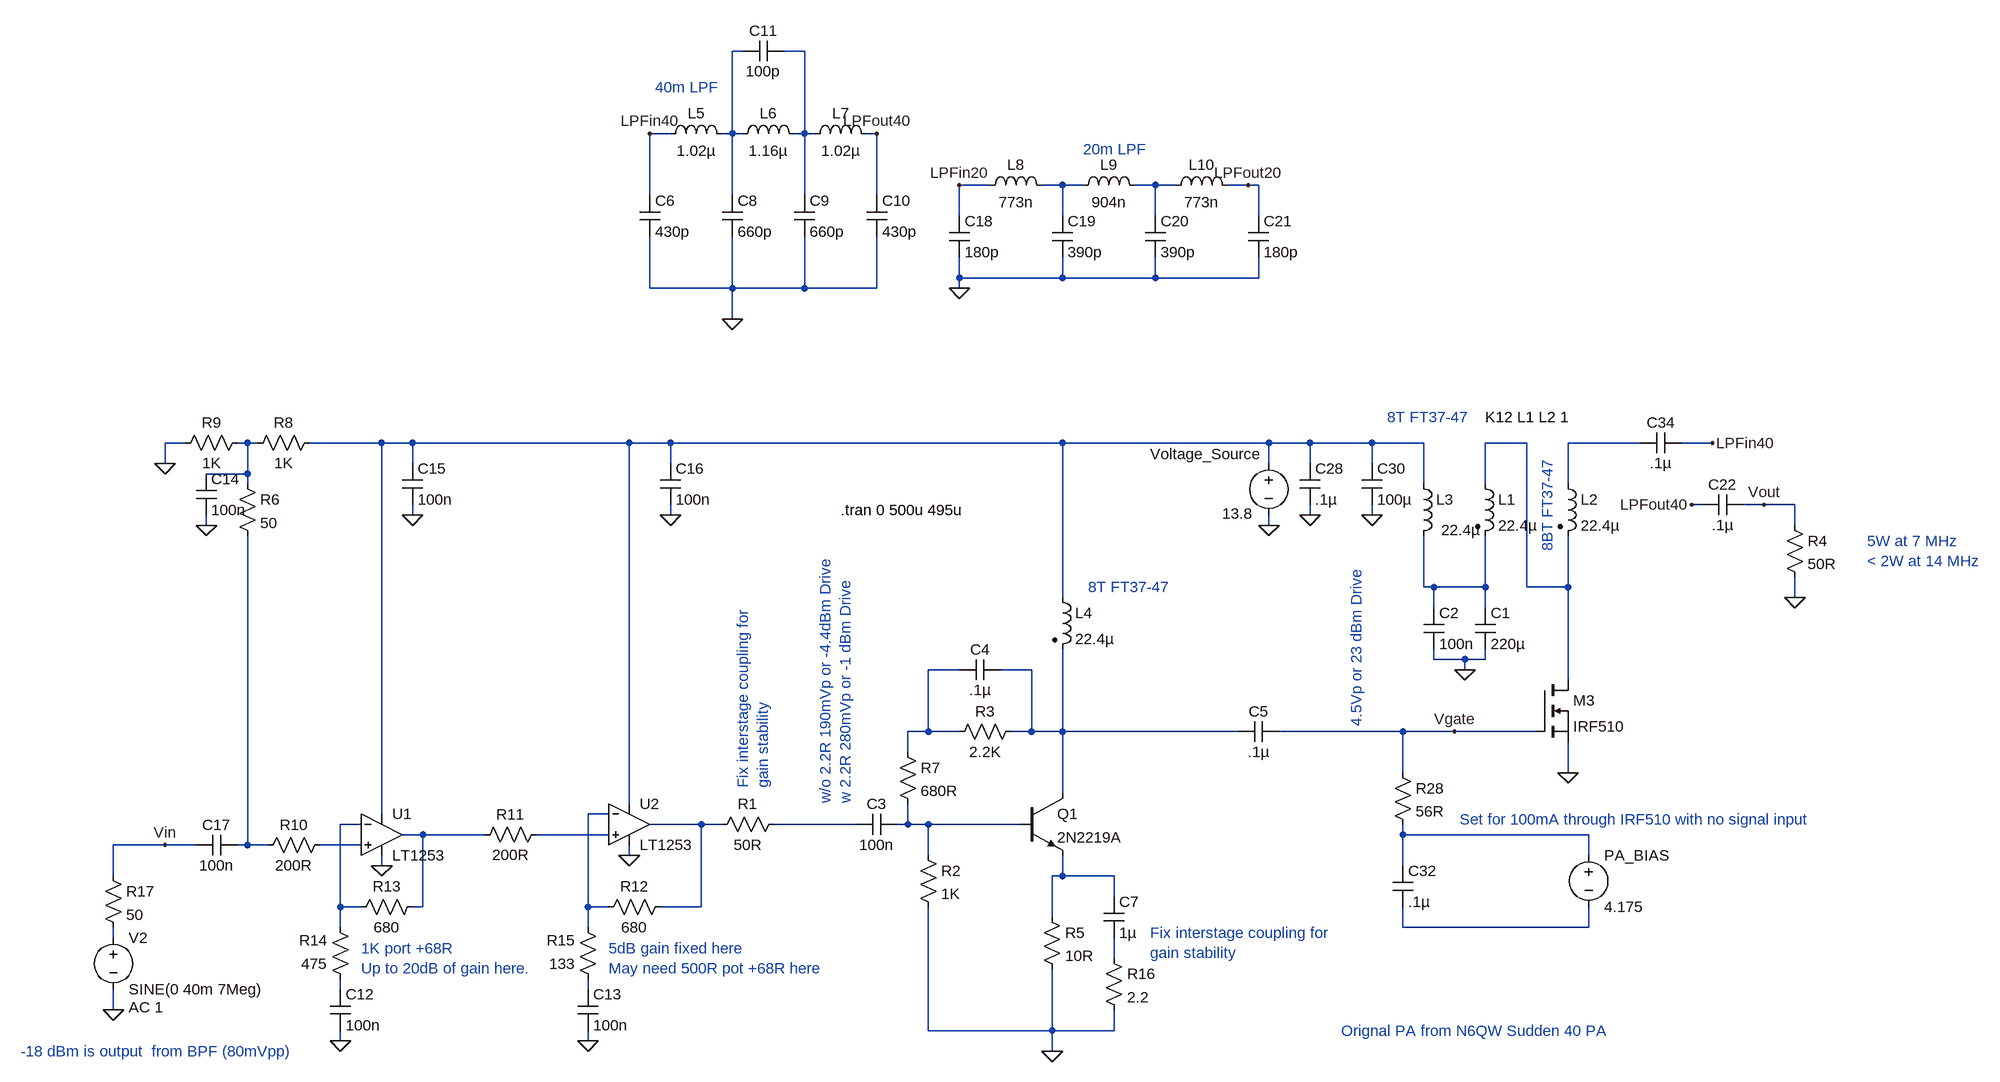
[diagram p0: schematic Power Amp LT1253+Driver+IRF510 Stage.asc]
Power Amp LT1253+Driver+IRF510 Stage.asc, the LTspice schematic file:
Version 4
SHEET 1 2716 3076
WIRE -368 784 -384 784
WIRE -272 784 -304 784
WIRE -480 912 -512 912
WIRE -384 912 -384 784
WIRE -384 912 -400 912
WIRE -368 912 -384 912
WIRE -272 912 -272 784
WIRE -272 912 -288 912
WIRE -256 912 -272 912
WIRE -160 912 -176 912
WIRE 16 992 -32 992
WIRE 128 992 96 992
WIRE 160 992 128 992
WIRE 272 992 240 992
WIRE 304 992 272 992
WIRE 416 992 384 992
WIRE 432 992 416 992
WIRE -512 1008 -512 912
WIRE -384 1008 -384 912
WIRE -272 1008 -272 912
WIRE -160 1008 -160 912
WIRE -32 1040 -32 992
WIRE 128 1040 128 992
WIRE 272 1040 272 992
WIRE 432 1040 432 992
WIRE -32 1136 -32 1104
WIRE 128 1136 128 1104
WIRE 128 1136 -32 1136
WIRE 272 1136 272 1104
WIRE 272 1136 128 1136
WIRE 432 1136 432 1104
WIRE 432 1136 272 1136
WIRE -512 1152 -512 1072
WIRE -384 1152 -384 1072
WIRE -384 1152 -512 1152
WIRE -272 1152 -272 1072
WIRE -272 1152 -384 1152
WIRE -160 1152 -160 1072
WIRE -160 1152 -272 1152
WIRE -32 1152 -32 1136
WIRE -384 1200 -384 1152
WIRE -1232 1392 -1264 1392
WIRE -1136 1392 -1152 1392
WIRE -1120 1392 -1136 1392
WIRE -928 1392 -1040 1392
WIRE -880 1392 -928 1392
WIRE -544 1392 -880 1392
WIRE -480 1392 -544 1392
WIRE 128 1392 -480 1392
WIRE 448 1392 128 1392
WIRE 512 1392 448 1392
WIRE 608 1392 512 1392
WIRE 688 1392 608 1392
WIRE 848 1392 784 1392
WIRE 1024 1392 912 1392
WIRE 1136 1392 1088 1392
WIRE -1264 1424 -1264 1392
WIRE -880 1424 -880 1392
WIRE -480 1424 -480 1392
WIRE 448 1424 448 1392
WIRE 512 1424 512 1392
WIRE 608 1424 608 1392
WIRE -1136 1440 -1136 1392
WIRE -1136 1440 -1200 1440
WIRE -1136 1456 -1136 1440
WIRE 688 1456 688 1392
WIRE 784 1456 784 1392
WIRE 912 1456 912 1392
WIRE 1120 1488 1104 1488
WIRE 1216 1488 1184 1488
WIRE 1264 1488 1216 1488
WIRE -880 1504 -880 1488
WIRE -480 1504 -480 1488
WIRE 512 1504 512 1488
WIRE 608 1504 608 1488
WIRE -1200 1520 -1200 1504
WIRE 448 1520 448 1504
WIRE 1264 1520 1264 1488
WIRE 688 1616 688 1536
WIRE 704 1616 688 1616
WIRE 784 1616 784 1536
WIRE 784 1616 704 1616
WIRE 848 1616 848 1392
WIRE 912 1616 912 1536
WIRE 912 1616 848 1616
WIRE 128 1632 128 1392
WIRE 1264 1632 1264 1600
WIRE 704 1648 704 1616
WIRE 784 1648 784 1616
WIRE 704 1728 704 1712
WIRE 752 1728 704 1728
WIRE 784 1728 784 1712
WIRE 784 1728 752 1728
WIRE -32 1744 -80 1744
WIRE 80 1744 32 1744
WIRE 752 1744 752 1728
WIRE 912 1760 912 1616
WIRE -80 1840 -80 1744
WIRE -80 1840 -112 1840
WIRE -32 1840 -80 1840
WIRE 80 1840 80 1744
WIRE 80 1840 48 1840
WIRE 128 1840 128 1712
WIRE 128 1840 80 1840
WIRE 400 1840 128 1840
WIRE 656 1840 464 1840
WIRE 736 1840 656 1840
WIRE 864 1840 736 1840
WIRE -112 1872 -112 1840
WIRE 656 1904 656 1840
WIRE 912 1904 912 1856
WIRE 128 1936 128 1840
WIRE -544 1952 -544 1392
WIRE -928 1968 -928 1392
WIRE -576 1968 -608 1968
WIRE -960 1984 -992 1984
WIRE -432 1984 -512 1984
WIRE -400 1984 -432 1984
WIRE -192 1984 -320 1984
WIRE -112 1984 -112 1952
WIRE -112 1984 -128 1984
WIRE -80 1984 -112 1984
WIRE 64 1984 -80 1984
WIRE -864 2000 -896 2000
WIRE -768 2000 -864 2000
WIRE -576 2000 -688 2000
WIRE 656 2000 656 1984
WIRE 944 2000 656 2000
WIRE -1264 2016 -1344 2016
WIRE -1216 2016 -1264 2016
WIRE -1136 2016 -1136 1536
WIRE -1136 2016 -1152 2016
WIRE -1104 2016 -1136 2016
WIRE -960 2016 -1024 2016
WIRE -544 2032 -544 2016
WIRE -80 2032 -80 1984
WIRE 944 2032 944 2000
WIRE -928 2048 -928 2032
WIRE 656 2048 656 2000
WIRE -1344 2064 -1344 2016
WIRE 128 2064 128 2032
WIRE 128 2064 112 2064
WIRE 208 2064 128 2064
WIRE 208 2096 208 2064
WIRE -992 2112 -992 1984
WIRE -960 2112 -992 2112
WIRE -864 2112 -864 2000
WIRE -864 2112 -880 2112
WIRE -608 2112 -608 1968
WIRE -576 2112 -608 2112
WIRE -432 2112 -432 1984
WIRE -432 2112 -496 2112
WIRE 112 2128 112 2064
WIRE -992 2144 -992 2112
WIRE -608 2144 -608 2112
WIRE 656 2144 656 2112
WIRE 944 2144 944 2112
WIRE 944 2144 656 2144
WIRE -1344 2160 -1344 2144
WIRE 208 2192 208 2160
WIRE -992 2240 -992 2224
WIRE -608 2240 -608 2224
WIRE -1344 2272 -1344 2240
WIRE -80 2304 -80 2112
WIRE 112 2304 112 2208
WIRE 112 2304 -80 2304
WIRE 208 2304 208 2272
WIRE 208 2304 112 2304
WIRE -992 2320 -992 2304
WIRE -608 2320 -608 2304
WIRE 112 2336 112 2304
FLAG 512 1504 0
FLAG 608 1504 0
FLAG 912 1904 0
FLAG 736 1840 Vgate
FLAG 448 1520 0
FLAG 752 1744 0
FLAG -1264 2016 Vin
FLAG 112 2336 0
FLAG 1264 1632 0
FLAG 1216 1488 Vout
FLAG -384 1200 0
FLAG -880 1504 0
FLAG -1200 1520 0
FLAG -928 2048 0
FLAG -544 2032 0
FLAG -608 2320 0
FLAG -1344 2272 0
FLAG -480 1504 0
FLAG -1264 1424 0
FLAG -992 2320 0
FLAG -32 1152 0
FLAG -512 912 LPFin40
FLAG -160 912 LPFout40
FLAG -32 992 LPFin20
FLAG 416 992 LPFout20
FLAG 1104 1488 LPFout40
FLAG 1136 1392 LPFin40
SYMBOL nmos 864 1760 R0
SYMATTR InstName M3
SYMATTR Value IRF510
SYMBOL voltage 448 1408 R0
WINDOW 123 0 0 Left 2
WINDOW 39 0 0 Left 2
WINDOW 0 -184 1 Left 2
WINDOW 3 -72 94 Left 2
SYMATTR InstName Voltage_Source
SYMATTR Value 13.8
SYMBOL cap 496 1424 R0
SYMATTR InstName C28
SYMATTR Value .1µ
SYMBOL ind2 768 1440 R0
SYMATTR InstName L1
SYMATTR Value 22.4µ
SYMATTR Type ind
SYMBOL ind2 896 1440 R0
SYMATTR InstName L2
SYMATTR Value 22.4µ
SYMATTR Type ind
SYMBOL ind 672 1440 R0
WINDOW 3 43 87 Left 2
SYMATTR Value 22.4µ
SYMATTR InstName L3
SYMBOL cap 592 1424 R0
SYMATTR InstName C30
SYMATTR Value 100µ
SYMBOL res 640 1888 R0
SYMATTR InstName R28
SYMATTR Value 56R
SYMBOL cap 640 2048 R0
SYMATTR InstName C32
SYMATTR Value .1µ
SYMBOL voltage 944 2016 R0
WINDOW 123 0 0 Left 2
WINDOW 39 0 0 Left 2
SYMATTR InstName PA_BIAS
SYMATTR Value 4.175
SYMBOL cap 1088 1376 R90
WINDOW 0 0 32 VBottom 2
WINDOW 3 32 32 VTop 2
SYMATTR InstName C34
SYMATTR Value .1µ
SYMBOL cap 768 1648 R0
SYMATTR InstName C1
SYMATTR Value 220µ
SYMBOL cap 688 1648 R0
SYMATTR InstName C2
SYMATTR Value 100n
SYMBOL npn 64 1936 R0
SYMATTR InstName Q1
SYMATTR Value 2N2219A
SYMBOL res -96 2016 R0
SYMATTR InstName R2
SYMATTR Value 1K
SYMBOL res 64 1824 R90
WINDOW 0 0 56 VBottom 2
WINDOW 3 32 56 VTop 2
SYMATTR InstName R3
SYMATTR Value 2.2K
SYMBOL cap 32 1728 R90
WINDOW 0 0 32 VBottom 2
WINDOW 3 32 32 VTop 2
SYMATTR InstName C4
SYMATTR Value .1µ
SYMBOL ind2 112 1616 R0
SYMATTR InstName L4
SYMATTR Value 22.4µ
SYMATTR Type ind
SYMBOL res 96 2112 R0
SYMATTR InstName R5
SYMATTR Value 10R
SYMBOL res -128 1856 R0
SYMATTR InstName R7
SYMATTR Value 680R
SYMBOL cap 192 2096 R0
SYMATTR InstName C7
SYMATTR Value 1µ
SYMBOL res 1248 1504 R0
SYMATTR InstName R4
SYMATTR Value 50R
SYMBOL ind -496 928 R270
WINDOW 0 32 56 VTop 2
WINDOW 3 5 56 VBottom 2
SYMATTR InstName L5
SYMATTR Value 1.02µ
SYMBOL ind -384 928 R270
WINDOW 0 32 56 VTop 2
WINDOW 3 5 56 VBottom 2
SYMATTR InstName L6
SYMATTR Value 1.16µ
SYMBOL ind -272 928 R270
WINDOW 0 32 56 VTop 2
WINDOW 3 5 56 VBottom 2
SYMATTR InstName L7
SYMATTR Value 1.02µ
SYMBOL cap -528 1008 R0
SYMATTR InstName C6
SYMATTR Value 430p
SYMBOL cap -400 1008 R0
SYMATTR InstName C8
SYMATTR Value 660p
SYMBOL cap -288 1008 R0
SYMATTR InstName C9
SYMATTR Value 660p
SYMBOL cap -176 1008 R0
SYMATTR InstName C10
SYMATTR Value 430p
SYMBOL cap -304 768 R90
WINDOW 0 0 32 VBottom 2
WINDOW 3 32 32 VTop 2
SYMATTR InstName C11
SYMATTR Value 100p
SYMBOL Opamps\\LT1253 -928 1936 R0
SYMATTR InstName U1
SYMBOL Opamps\\LT1253 -544 1920 R0
SYMATTR InstName U2
SYMBOL voltage -1344 2144 R0
WINDOW 123 24 124 Left 2
WINDOW 39 0 0 Left 2
SYMATTR Value2 AC 1
SYMATTR InstName V2
SYMATTR Value SINE(0 40m 7Meg)
SYMBOL res -1152 1440 R0
SYMATTR InstName R6
SYMATTR Value 50
SYMBOL res -1024 1376 R90
WINDOW 0 0 56 VBottom 2
WINDOW 3 32 56 VTop 2
SYMATTR InstName R8
SYMATTR Value 1K
SYMBOL res -1136 1376 R90
WINDOW 0 0 56 VBottom 2
WINDOW 3 32 56 VTop 2
SYMATTR InstName R9
SYMATTR Value 1K
SYMBOL res -1008 2000 R90
WINDOW 0 0 56 VBottom 2
WINDOW 3 32 56 VTop 2
SYMATTR InstName R10
SYMATTR Value 200R
SYMBOL res -672 1984 R90
WINDOW 0 0 56 VBottom 2
WINDOW 3 32 56 VTop 2
SYMATTR InstName R11
SYMATTR Value 200R
SYMBOL res -480 2096 R90
WINDOW 0 0 56 VBottom 2
WINDOW 3 32 56 VTop 2
SYMATTR InstName R12
SYMATTR Value 680
SYMBOL res -864 2096 R90
WINDOW 0 0 56 VBottom 2
WINDOW 3 32 56 VTop 2
SYMATTR InstName R13
SYMATTR Value 680
SYMBOL res -976 2240 R180
WINDOW 0 36 76 Left 2
WINDOW 3 36 40 Left 2
SYMATTR InstName R14
SYMATTR Value 475
SYMBOL res -592 2240 R180
WINDOW 0 36 76 Left 2
WINDOW 3 36 40 Left 2
SYMATTR InstName R15
SYMATTR Value 133
SYMBOL cap -1008 2240 R0
SYMATTR InstName C12
SYMATTR Value 100n
SYMBOL cap -624 2240 R0
SYMATTR InstName C13
SYMATTR Value 100n
SYMBOL cap -1216 1440 R0
SYMATTR InstName C14
SYMATTR Value 100n
SYMBOL cap -896 1424 R0
SYMATTR InstName C15
SYMATTR Value 100n
SYMBOL cap -496 1424 R0
SYMATTR InstName C16
SYMATTR Value 100n
SYMBOL cap -1152 2000 R90
WINDOW 0 0 32 VBottom 2
WINDOW 3 32 32 VTop 2
SYMATTR InstName C17
SYMATTR Value 100n
SYMBOL res -1360 2048 R0
SYMATTR InstName R17
SYMATTR Value 50
SYMBOL res -304 1968 R90
WINDOW 0 0 56 VBottom 2
WINDOW 3 32 56 VTop 2
SYMATTR InstName R1
SYMATTR Value 50R
SYMBOL cap -128 1968 R90
WINDOW 0 0 32 VBottom 2
WINDOW 3 32 32 VTop 2
SYMATTR InstName C3
SYMATTR Value 100n
SYMBOL cap 464 1824 R90
WINDOW 0 0 32 VBottom 2
WINDOW 3 32 32 VTop 2
SYMATTR InstName C5
SYMATTR Value .1µ
SYMBOL res 192 2176 R0
SYMATTR InstName R16
SYMATTR Value 2.2
SYMBOL ind 0 1008 R270
WINDOW 0 32 56 VTop 2
WINDOW 3 5 56 VBottom 2
SYMATTR InstName L8
SYMATTR Value 773n
SYMBOL ind 144 1008 R270
WINDOW 0 32 56 VTop 2
WINDOW 3 5 56 VBottom 2
SYMATTR InstName L9
SYMATTR Value 904n
SYMBOL ind 288 1008 R270
WINDOW 0 32 56 VTop 2
WINDOW 3 5 56 VBottom 2
SYMATTR InstName L10
SYMATTR Value 773n
SYMBOL cap -48 1040 R0
SYMATTR InstName C18
SYMATTR Value 180p
SYMBOL cap 112 1040 R0
SYMATTR InstName C19
SYMATTR Value 390p
SYMBOL cap 256 1040 R0
SYMATTR InstName C20
SYMATTR Value 390p
SYMBOL cap 416 1040 R0
SYMATTR InstName C21
SYMATTR Value 180p
SYMBOL cap 1184 1472 R90
WINDOW 0 0 32 VBottom 2
WINDOW 3 32 32 VTop 2
SYMATTR InstName C22
SYMATTR Value .1µ
TEXT 784 1352 Left 2 !K12 L1 L2 1
TEXT 744 1976 Left 2 ;Set for 100mA through IRF510 with no signal input
TEXT 584 1832 VLeft 2 ;4.5Vp or 23 dBm Drive
TEXT -216 1496 Left 2 !.tran 0 500u 495u
TEXT -1488 2336 Left 2 ;-18 dBm is output  from BPF (80mVpp)
TEXT -240 1952 VLeft 2 ;w/o 2.2R 190mVp or -4.4dBm Drive\nw 2.2R 280mVp or -1 dBm Drive
TEXT -576 2176 Left 2 ;5dB gain fixed here\nMay need 500R pot +68R here
TEXT -960 2176 Left 2 ;1K port +68R  \nUp to 20dB of gain here.
TEXT -368 1928 VLeft 2 ;Fix interstage coupling for\ngain stability
TEXT 168 1616 Left 2 ;8T FT37-47
TEXT 632 1352 Left 2 ;8T FT37-47
TEXT 880 1560 VLeft 2 ;8BT FT37-47
TEXT 264 2152 Left 2 ;Fix interstage coupling for\ngain stability
TEXT 560 2304 Left 2 ;Orignal PA from N6QW Sudden 40 PA
TEXT 1376 1544 Left 2 ;5W at 7 MHz\n< 2W at 14 MHz
TEXT 160 936 Left 2 ;20m LPF
TEXT -504 840 Left 2 ;40m LPF

The netlist it stands for:
* Power Amp LT1253+Driver+IRF510 Stage.asc
M3 N007 Vgate 0 0 IRF510
Voltage_Source N006 0 13.8
C28 N006 0 .1µ
L1 N007 N009 22.4µ
L2 N008 N007 22.4µ
L3 N006 N009 22.4µ
C30 N006 0 100µ
R28 Vgate N019 56R
C32 N019 N023 .1µ
V§PA_BIAS N019 N023 4.175
C34 LPFin40 N008 .1µ
C1 N009 0 220µ
C2 N009 0 100n
Q1 N011 N016 N022 0 2N2219A
R2 N016 0 1K
R3 N011 N010 2.2K
C4 N011 N010 .1µ
L4 N006 N011 22.4µ
R5 N022 0 10R
R7 N010 N016 680R
C7 N022 N025 1µ
R4 Vout 0 50R
L5 LPFin40 N001 1.02µ
L6 N001 N002 1.16µ
L7 N002 LPFout40 1.02µ
C6 LPFin40 0 430p
C8 N001 0 660p
C9 N002 0 660p
C10 LPFout40 0 430p
C11 N002 N001 100p
XU1 N021 N013 N006 0 N017 LT1253  ; pins In+ In- V+ V- OUT
XU2 N018 N012 N006 0 N014 LT1253  ; pins In+ In- V+ V- OUT
V2 N024 0 SINE(0 40m 7Meg) AC 1
R6 N005 N020 50
R8 N006 N005 1K
R9 N005 0 1K
R10 N021 N020 200R
R11 N018 N017 200R
R12 N014 N012 680
R13 N017 N013 680
R14 N026 N013 475
R15 N027 N012 133
C12 N026 0 100n
C13 N027 0 100n
C14 N005 0 100n
C15 N006 0 100n
C16 N006 0 100n
C17 N020 Vin 100n
R17 Vin N024 50
R1 N015 N014 50R
C3 N016 N015 100n
C5 Vgate N011 .1µ
R16 N025 0 2.2
L8 LPFin20 N003 773n
L9 N003 N004 904n
L10 N004 LPFout20 773n
C18 LPFin20 0 180p
C19 N003 0 390p
C20 N004 0 390p
C21 LPFout20 0 180p
C22 Vout LPFout40 .1µ
.model NPN NPN
.model PNP PNP
.lib standard.bjt
.model NMOS NMOS
.model PMOS PMOS
.lib standard.mos
K12 L1 L2 1
* Set for 100mA through IRF510 with no signal input
* 4.5Vp or 23 dBm Drive
.tran 0 500u 495u
* -18 dBm is output  from BPF (80mVpp)
* w/o 2.2R 190mVp or -4.4dBm Drive
* w 2.2R 280mVp or -1 dBm Drive
* 5dB gain fixed here
* May need 500R pot +68R here
* 1K port +68R
* Up to 20dB of gain here.
* Fix interstage coupling for
* gain stability
* 8T FT37-47
* 8T FT37-47
* 8BT FT37-47
* Fix interstage coupling for
* gain stability
* Orignal PA from N6QW Sudden 40 PA
* 5W at 7 MHz
* < 2W at 14 MHz
* 20m LPF
* 40m LPF
.backanno
.end